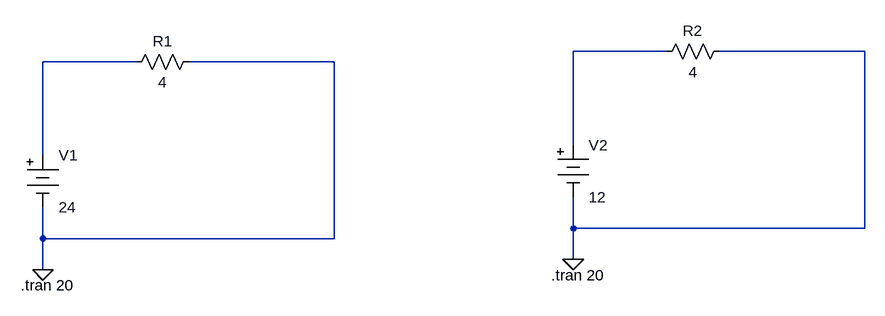
[diagram p0: schematic Course_Project_Tonino_Kent_Louise.asc]
Course_Project_Tonino_Kent_Louise.asc, the LTspice schematic file:
Version 4
SHEET 1 1412 680
WIRE 1104 -80 960 -80
WIRE 1408 -80 1184 -80
WIRE 288 -64 144 -64
WIRE 592 -64 368 -64
WIRE 960 64 960 -80
WIRE 144 80 144 -64
WIRE 960 192 960 144
WIRE 1408 192 1408 -80
WIRE 1408 192 960 192
WIRE 144 208 144 160
WIRE 592 208 592 -64
WIRE 592 208 144 208
WIRE 960 240 960 192
WIRE 144 256 144 208
FLAG 144 256 0
FLAG 960 240 0
SYMBOL res 272 -48 R270
WINDOW 0 32 56 VTop 2
WINDOW 3 0 56 VBottom 2
SYMATTR InstName R1
SYMATTR Value 4
SYMBOL Misc\\battery 144 64 R0
WINDOW 123 0 0 Left 0
WINDOW 39 0 0 Left 0
SYMATTR InstName V1
SYMATTR Value 24
SYMBOL res 1088 -64 R270
WINDOW 0 32 56 VTop 2
WINDOW 3 0 56 VBottom 2
SYMATTR InstName R2
SYMATTR Value 4
SYMBOL Misc\\battery 960 48 R0
WINDOW 123 0 0 Left 0
WINDOW 39 0 0 Left 0
SYMATTR InstName V2
SYMATTR Value 12
TEXT 110 280 Left 2 !.tran 20
TEXT 926 264 Left 2 !.tran 20

The netlist it stands for:
* Course_Project_Tonino_Kent_Louise.asc
R1 N002 0 4
V1 N002 0 24
R2 N001 0 4
V2 N001 0 12
.tran 20
.tran 20
.backanno
.end